# EAGLE schematic Jetson TK1 (EAGLE 8.7.1)
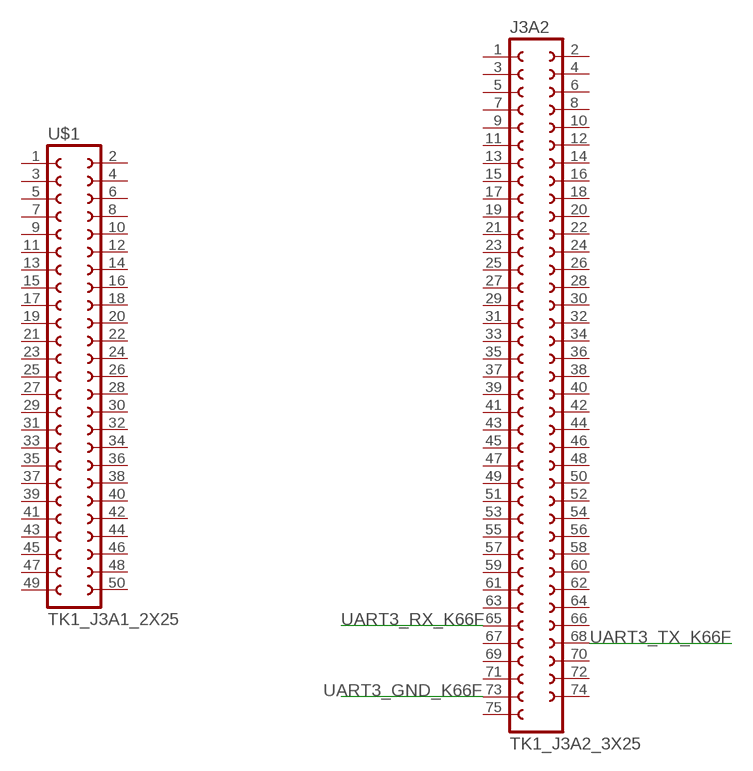
[diagram p0: schematic, sheet 1]

## Parts
J3A2  TK1_J3A2_3X25  [TK1_IO_3X25]
U$1  TK1_J3A1_2X25  [TK1_IO_2X25]

## Nets
UART3_GND_K66F: J3A2.73
UART3_RX_K66F: J3A2.65
UART3_TX_K66F: J3A2.68
Unconnected: J3A2.1 J3A2.2 J3A2.3 J3A2.4 J3A2.5 J3A2.6 J3A2.7 J3A2.8 J3A2.9 J3A2.10 J3A2.11 J3A2.12 J3A2.13 J3A2.14 J3A2.15 J3A2.16 J3A2.17 J3A2.18 J3A2.19 J3A2.20 J3A2.21 J3A2.22 J3A2.23 J3A2.24 J3A2.25 J3A2.26 J3A2.27 J3A2.28 J3A2.29 J3A2.30 J3A2.31 J3A2.32 J3A2.33 J3A2.34 J3A2.35 J3A2.36 J3A2.37 J3A2.38 J3A2.39 J3A2.40 J3A2.41 J3A2.42 J3A2.43 J3A2.44 J3A2.45 J3A2.46 J3A2.47 J3A2.48 J3A2.49 J3A2.50 J3A2.51 J3A2.52 J3A2.53 J3A2.54 J3A2.55 J3A2.56 J3A2.57 J3A2.58 J3A2.59 J3A2.60 J3A2.61 J3A2.62 J3A2.63 J3A2.64 J3A2.66 J3A2.67 J3A2.69 J3A2.70 J3A2.71 J3A2.72 J3A2.74 J3A2.75 U$1.1 U$1.2 U$1.3 U$1.4 U$1.5 U$1.6 U$1.7 U$1.8 U$1.9 U$1.10 U$1.11 U$1.12 U$1.13 U$1.14 U$1.15 U$1.16 U$1.17 U$1.18 U$1.19 U$1.20 U$1.21 U$1.22 U$1.23 U$1.24 U$1.25 U$1.26 U$1.27 U$1.28 U$1.29 U$1.30 U$1.31 U$1.32 U$1.33 U$1.34 U$1.35 U$1.36 U$1.37 U$1.38 U$1.39 U$1.40 U$1.41 U$1.42 U$1.43 U$1.44 U$1.45 U$1.46 U$1.47 U$1.48 U$1.49 U$1.50

## Library data of the parts
J3A2 = Parts:TK1_J3A2_3X25
U$1 = Parts:TK1_J3A1_2X25